# Altium schematic sheet Mainboard.SchDoc
size A2; SheetNumber: 1; SheetTotal: 1
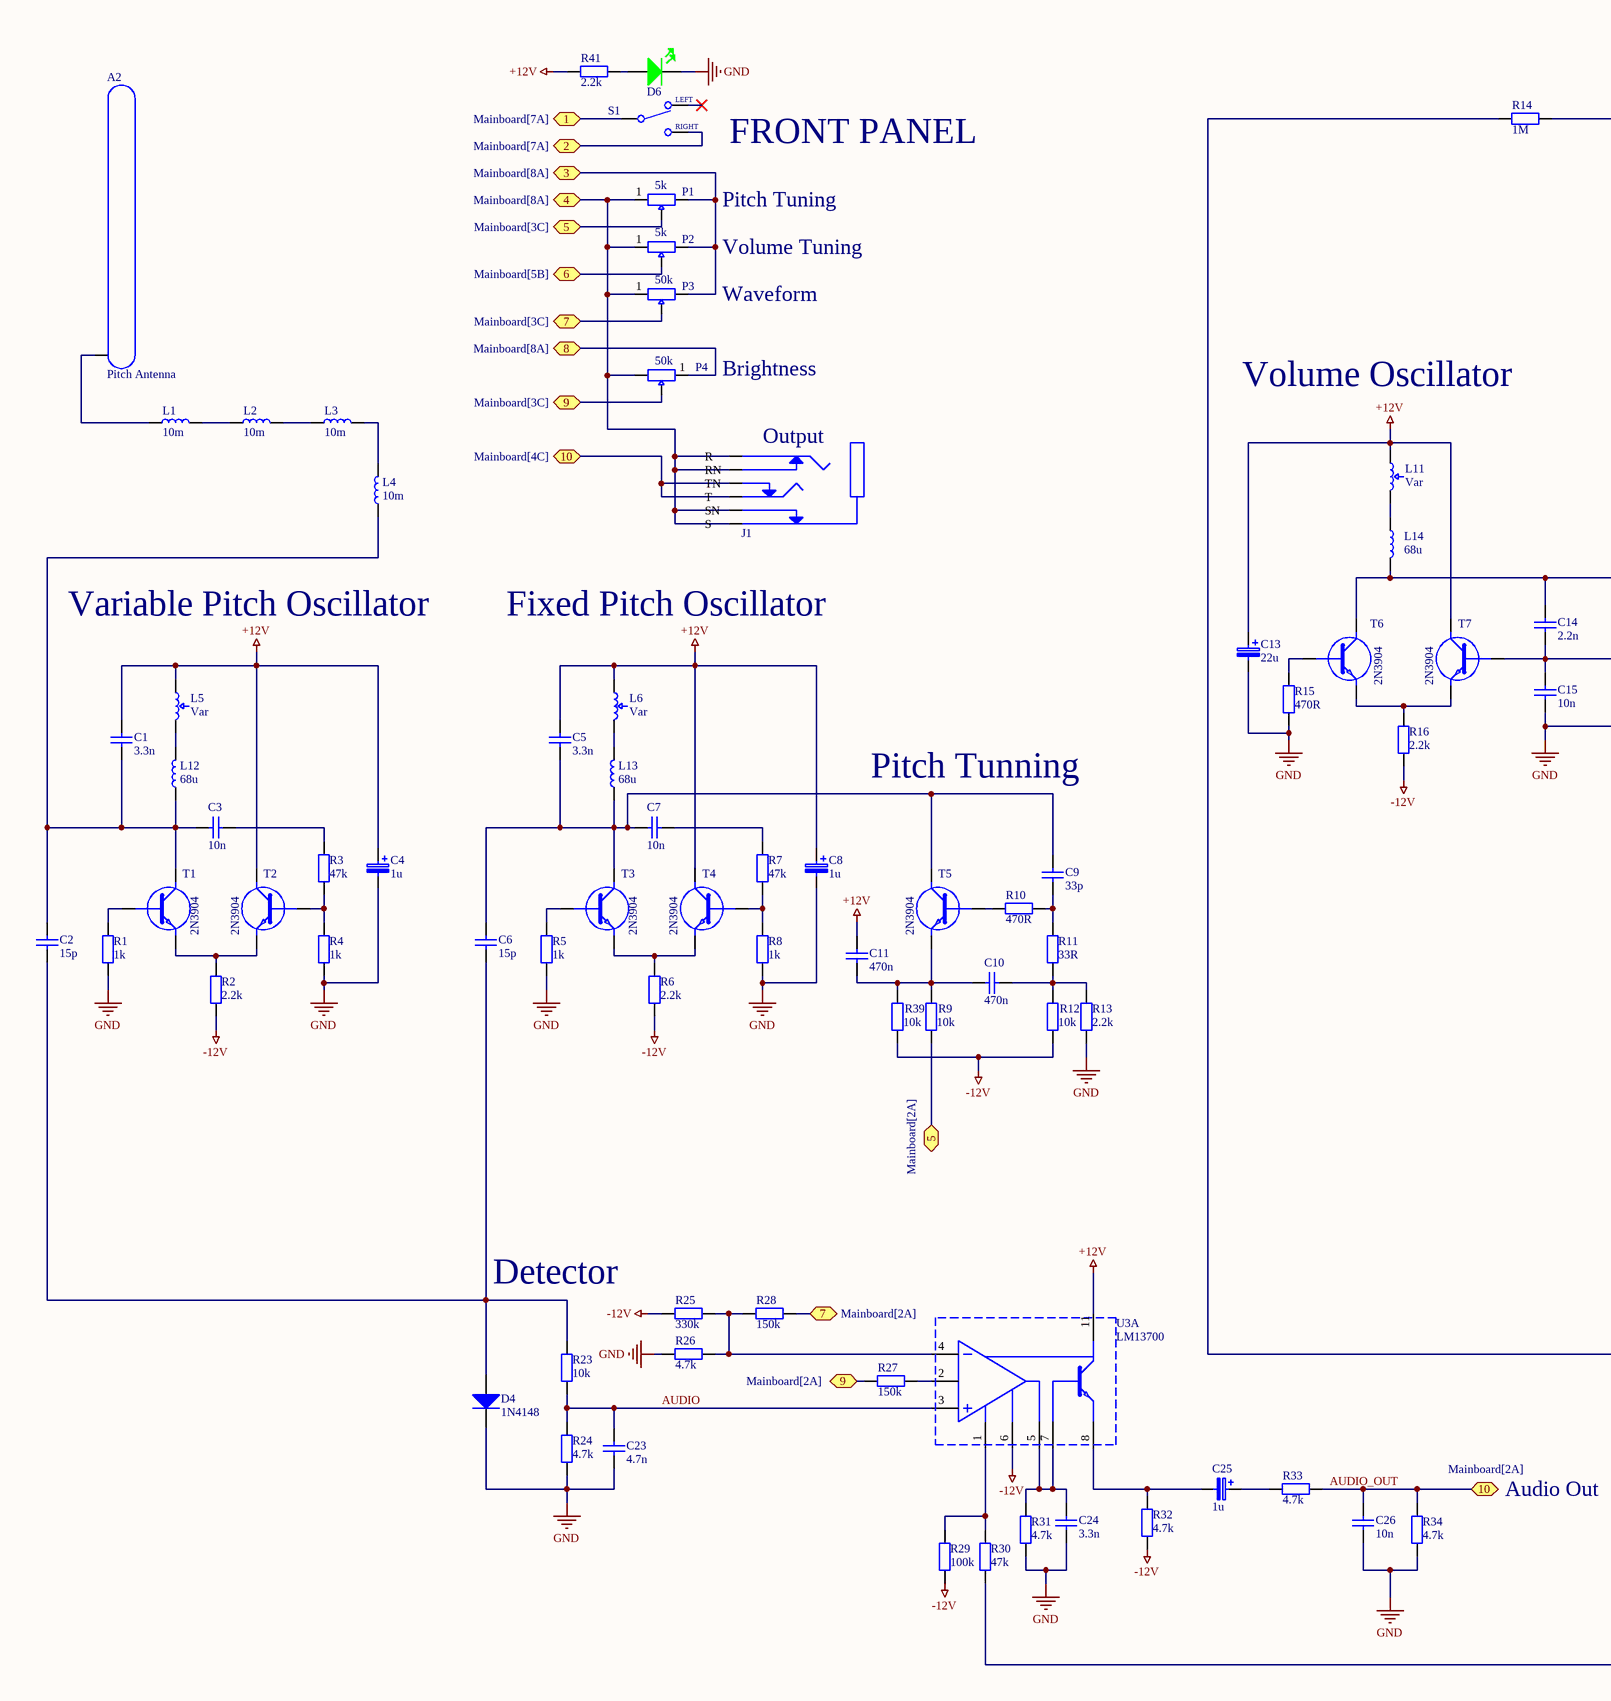
[diagram p0: Mainboard.SchDoc, left]
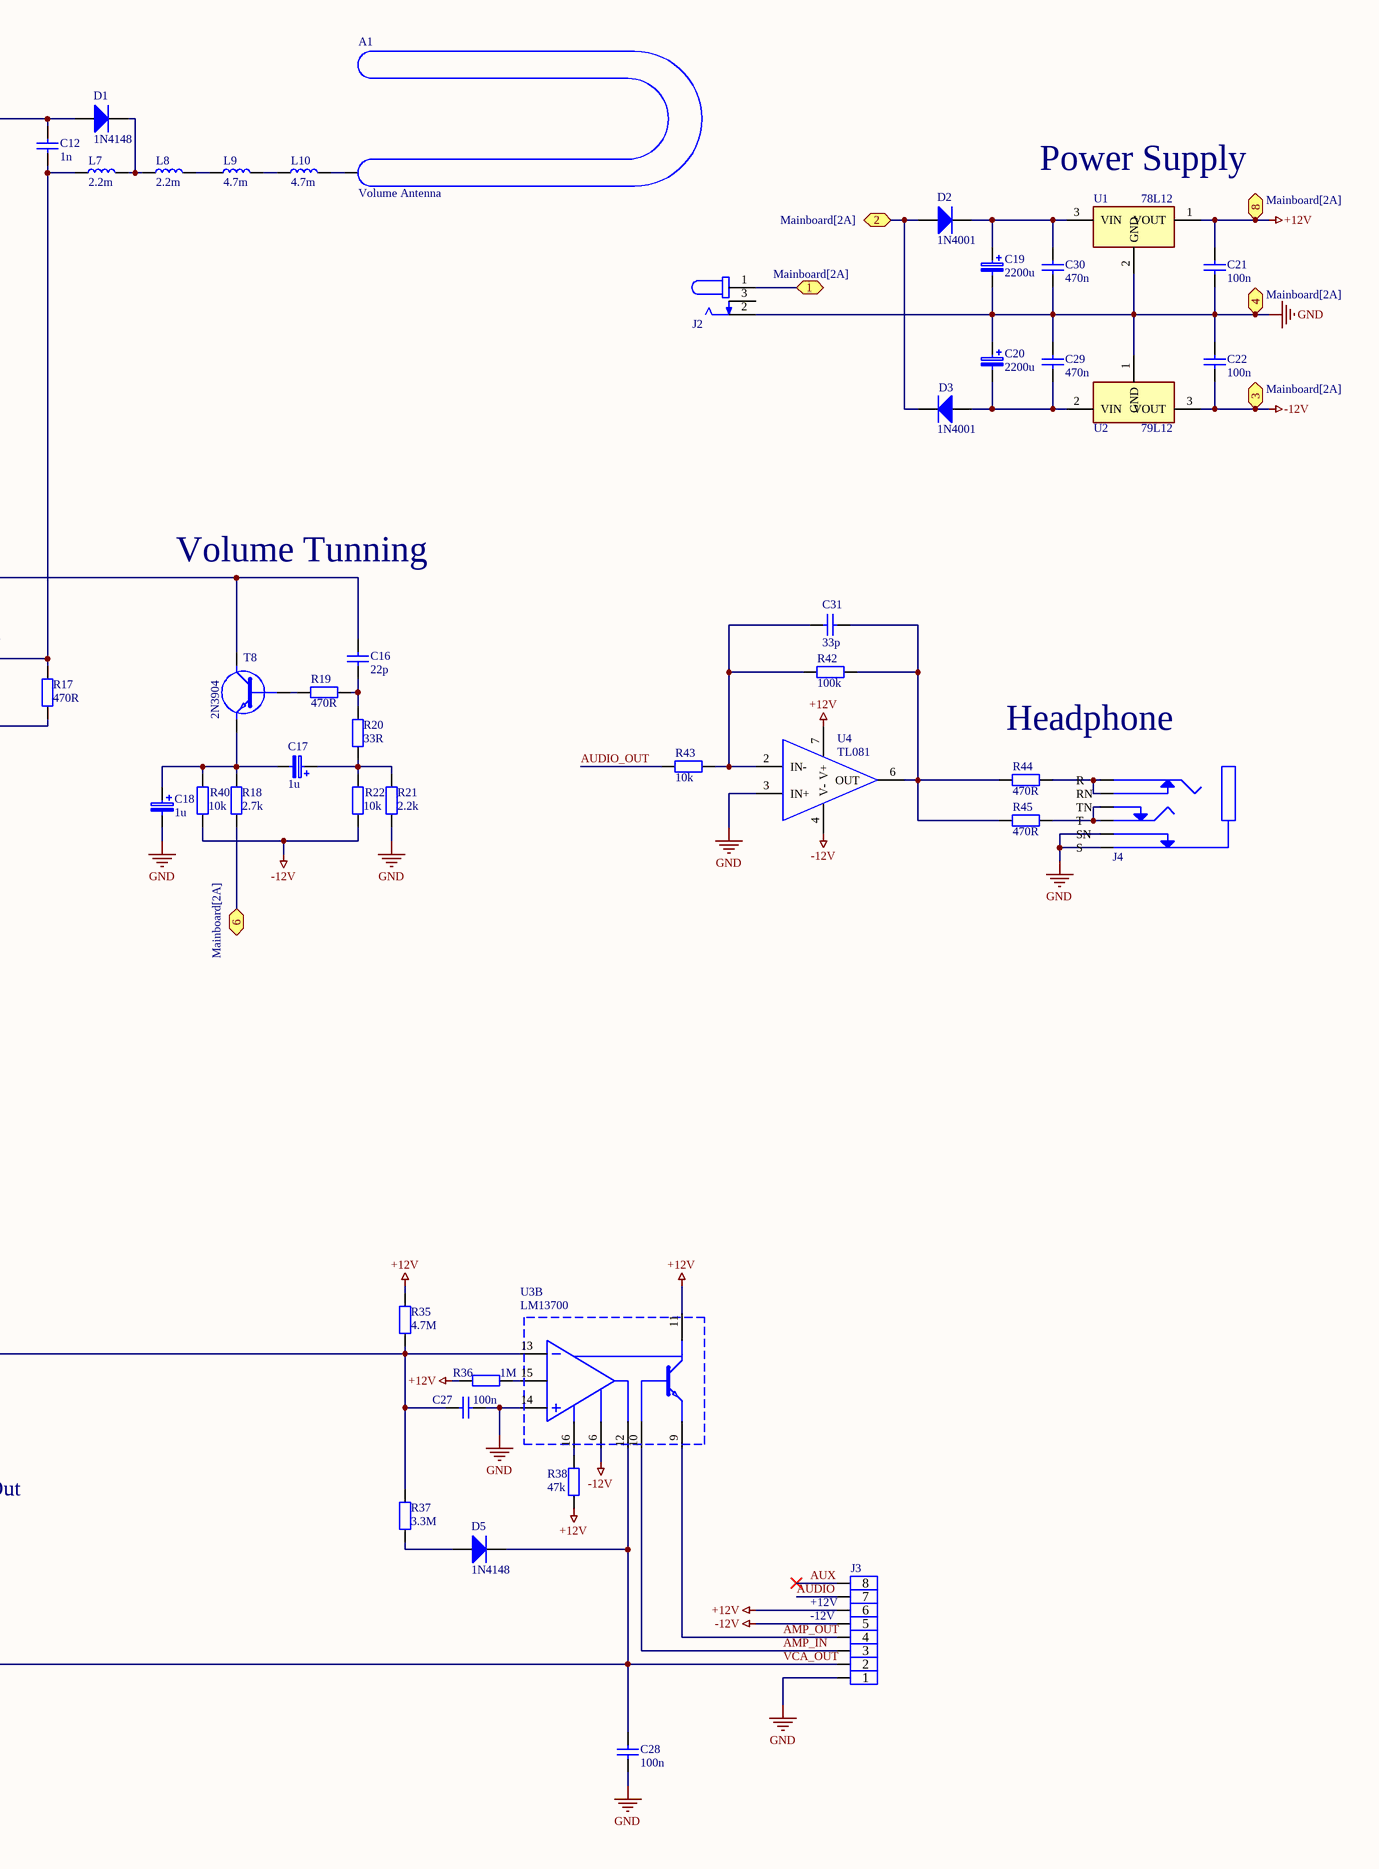
[diagram p1: Mainboard.SchDoc, right]

## Parts
A1  Volume Antenna  [HOLE M3]
A2  Pitch Antenna  [HOLE M3]
C1  3.3n  [Capacitor 7.2x3.5x6.5mm]
C2  15p  [Capacitor Ceramic]
C3  10n  [Capacitor 7.2x3.5x6.5mm]
C4  1u  [Capacitor Tantalum 5.08mm]
C5  3.3n  [Capacitor 7.2x3.5x6.5mm]
C6  15p  [Capacitor Ceramic]
C7  10n  [Capacitor 7.2x3.5x6.5mm]
C8  1u  [Capacitor Tantalum 5.08mm]
C9  33p  [Capacitor Ceramic]
C10  470n  [Capacitor 7.2x3.5x6.5mm]
C11  470n  [Capacitor 7.2x3.5x6.5mm]
C12  1n  [Capacitor 7.2x3.5x6.5mm]
C13  22u  [Capacitor Tantalum 5.08mm]
C14  2.2n  [Capacitor 7.2x3.5x6.5mm]
C15  10n  [Capacitor 7.2x3.5x6.5mm]
C16  22p  [Capacitor Ceramic]
C17  1u  [Capacitor Tantalum 5.08mm]
C18  1u  [Capacitor Tantalum 5.08mm]
C19  2200u  [Capacitor Electrolytic 16x25mm]
C20  2200u  [Capacitor Electrolytic 16x25mm]
C21  100n  [Capacitor 7.2x3.5x6.5mm]
C22  100n  [Capacitor 7.2x3.5x6.5mm]
C23  4.7n  [Capacitor 7.2x3.5x6.5mm]
C24  3.3n  [Capacitor 7.2x3.5x6.5mm]
C25  1u  [Capacitor Tantalum 5.08mm]
C26  10n  [Capacitor 7.2x3.5x6.5mm]
C27  100n  [Capacitor 7.2x3.5x6.5mm]
C28  100n  [Capacitor 7.2x3.5x6.5mm]
C29  470n  [Capacitor 7.2x3.5x6.5mm]
C30  470n  [Capacitor 7.2x3.5x6.5mm]
C31  33p  [Capacitor Ceramic]
D1  1N4148  [DO35]
D2  1N4001  [DO41]
D3  1N4001  [DO41]
D4  1N4148  [DO35]
D5  1N4148  [DO35]
D6  Green  [LED 5mm]  (value not drawn)
J1  JC-211  [Jack 6.3mm PCB]  (value not drawn)
J2  PC-GK2.1  [DC Supply THT]  (value not drawn)
J3  8 PIN  [Goldpin 8P]  (value not drawn)
J4  JC-211  [Jack 6.3mm PCB]  (value not drawn)
L1  10m  [Inductor 11.5x11.5]
L2  10m  [Inductor 11.5x11.5]
L3  10m  [Inductor 11.5x11.5]
L4  10m  [Inductor 11.5x11.5]
L5  Var  [Inductor Variable]
L6  Var  [Inductor Variable]
L7  2.2m  [Inductor 11.5x11.5]
L8  2.2m  [Inductor 11.5x11.5]
L9  4.7m  [Inductor 11.5x11.5]
L10  4.7m  [Inductor 11.5x11.5]
L11  Var  [Inductor Variable]
L12  68u  [Inductor Axial]
L13  68u  [Inductor Axial]
L14  68u  [Inductor Axial]
P1  5k  [Potentiometer Shaft]
P2  5k  [Potentiometer Shaft]
P3  50k  [Potentiometer Shaft]
P4  50k  [Potentiometer Shaft]
R1  1k  [Resistor 1/4W]
R2  2.2k  [Resistor 1/4W]
R3  47k  [Resistor 1/4W]
R4  1k  [Resistor 1/4W]
R5  1k  [Resistor 1/4W]
R6  2.2k  [Resistor 1/4W]
R7  47k  [Resistor 1/4W]
R8  1k  [Resistor 1/4W]
R9  10k  [Resistor 1/4W]
R10  470R  [Resistor 1/4W]
R11  33R  [Resistor 1/4W]
R12  10k  [Resistor 1/4W]
R13  2.2k  [Resistor 1/4W]
R14  1M  [Resistor 1/4W]
R15  470R  [Resistor 1/4W]
R16  2.2k  [Resistor 1/4W]
R17  470R  [Resistor 1/4W]
R18  2.7k  [Resistor 1/4W]
R19  470R  [Resistor 1/4W]
R20  33R  [Resistor 1/4W]
R21  2.2k  [Resistor 1/4W]
R22  10k  [Resistor 1/4W]
R23  10k  [Resistor 1/4W]
R24  4.7k  [Resistor 1/4W]
R25  330k  [Resistor 1/4W]
R26  4.7k  [Resistor 1/4W]
R27  150k  [Resistor 1/4W]
R28  150k  [Resistor 1/4W]
R29  100k  [Resistor 1/4W]
R30  47k  [Resistor 1/4W]
R31  4.7k  [Resistor 1/4W]
R32  4.7k  [Resistor 1/4W]
R33  4.7k  [Resistor 1/4W]
R34  4.7k  [Resistor 1/4W]
R35  4.7M  [Resistor 1/4W]
R36  1M  [Resistor 1/4W]
R37  3.3M  [Resistor 1/4W]
R38  47k  [Resistor 1/4W]
R39  10k  [Resistor 1/4W]
R40  10k  [Resistor 1/4W]
R41  2.2k  [Resistor 1/4W]
R42  100k  [Resistor 1/4W]
R43  10k  [Resistor 1/4W]
R44  470R  [Resistor 1/4W]
R45  470R  [Resistor 1/4W]
S1  ON-ON  [Switch Angled]  (value not drawn)
T1  2N3904  [TO-92]
T2  2N3904  [TO-92]
T3  2N3904  [TO-92]
T4  2N3904  [TO-92]
T5  2N3904  [TO-92]
T6  2N3904  [TO-92]
T7  2N3904  [TO-92]
T8  2N3904  [TO-92]
U1  78L12  [TO-92]
U2  79L12  [TO-92]
U3  LM13700  [SO-16]  (parts A,B of 2)
U4  TL081  [DIP-8]

## Ports
1 (bidir, see Mainboard[2A]), 1 (bidir, see Mainboard[7A]), 2 (bidir, see Mainboard[2A]), 2 (bidir, see Mainboard[7A]), 3 (bidir, see Mainboard[2A]), 3 (bidir, see Mainboard[8A]), 4 (bidir, see Mainboard[2A]), 4 (bidir, see Mainboard[8A]), 5 (bidir, see Mainboard[2A]), 5 (bidir, see Mainboard[3C]), 6 (bidir, see Mainboard[2A]), 6 (bidir, see Mainboard[5B]), 7 (bidir, see Mainboard[2A]), 7 (bidir, see Mainboard[3C]), 8 (bidir, see Mainboard[2A]), 8 (bidir, see Mainboard[8A]), 9 (bidir, see Mainboard[2A]), 9 (bidir, see Mainboard[3C]), 10 (bidir, see Mainboard[2A]), 10 (bidir, see Mainboard[4C])

## Nets
+12V: C1.2 C4.1 C5.2 C8.1 C11.2 C13.1 C21.1 J3.6 L5.2 L6.2 L11.2 P4.1 R35.2 R36.2 R38.1 R41.2 T2.3(C) T4.3(C) T7.3(C) U1.1(VOUT) U3.11(V+) U4.7(V+) ; port 8
-12V: C22.2 J3.5 P1.3 P2.3 P3.3 R2.1 R6.1 R12.1 R16.1 R22.1 R25.1 R29.1 R32.1 R39.1 R40.1 U2.3(VOUT) U3.6(V-) U4.4(V-) ; port 3
GND: C4.2 C8.2 C13.2 C15.1 C18.2 C19.2 C20.1 C21.2 C22.1 C23.1 C24.1 C26.1 C27.1 C28.1 C29.2 C30.1 D4.2 D6.2 J1.1(S) J1.2(R) J1.5(RN) J1.6(SN) J2.2 J3.1 J4.1(S) J4.6(SN) P1.1 P2.1 P3.1 P4.3 R1.1 R4.1 R5.1 R8.1 R13.1 R15.1 R17.1 R21.1 R24.1 R26.1 R31.1 R34.2 U1.2(GND) U2.1(GND) U3.14(+) U4.3(IN+) ; port 4
1: J2.1 S1.2 ; port 1
2: D2.1 D3.2 S1.3 ; port 2
5: P1.2 R9.1 ; port 5
6: P2.2 R18.1 ; port 6
7: P3.2 R28.2 ; port 7
9: P4.2 R27.2 ; port 9
AMP_IN: J3.3 U3.10(BUFFER_IN)
AMP_OUT: J3.4 U3.9(BUFFER_OUT)
AUDIO: C23.2 J3.7 R23.2 R24.2 U3.3(+)
AUDIO_OUT: C26.2 J1.3(T) J1.4(TN) R33.1 R34.1 R43.1 ; port 10
AUX: J3.8
VCA_OUT: C28.2 D5.2 J3.2 R30.1 U3.12(OUTPUT)
NetA1_1: A1.1 L10.2
NetA2_1: A2.1 L1.1
NetC1_1: C1.1 C2.2 C3.1 L4.1 L12.1 T1.3(C)
NetC2_1: C2.1 C6.1 D4.1 R23.1
NetC3_2: C3.2 R3.2
NetC5_1: C5.1 C6.2 C7.1 C9.2 L13.1 T3.3(C) T5.3(C)
NetC7_2: C7.2 R7.2
NetC9_1: C9.1 R10.2 R11.2
NetC10_1: C10.1 R11.1 R12.2 R13.2
NetC10_2: C10.2 C11.1 R9.2 R39.2 T5.1(E)
NetC12_1: C12.1 C14.1 C15.2 L7.1 R17.2 T7.2(B)
NetC12_2: C12.2 D1.1 R14.2
NetC14_2: C14.2 C16.2 L14.2 T6.3(C) T8.3(C)
NetC16_1: C16.1 R19.2 R20.2
NetC17_1: C17.1 R20.1 R21.2 R22.2
NetC17_2: C17.2 C18.1 R18.2 R40.2 T8.1(E)
NetC19_1: C19.1 C30.2 D2.2 U1.3(VIN)
NetC20_2: C20.2 C29.1 D3.1 U2.2(VIN)
NetC24_2: C24.2 R31.2 U3.5(OUTPUT) U3.7(BUFFER_IN)
NetC25_1: C25.1 R33.2
NetC25_2: C25.2 R32.2 U3.8(BUFFER_OUT)
NetC27_2: C27.2 R14.1 R35.1 R37.2 U3.13(-)
NetC31_1: C31.1 R42.1 R43.2 U4.2(IN-)
NetC31_2: C31.2 R42.2 R44.1 R45.1 U4.6(OUT)
NetD1_2: D1.2 L7.2 L8.1
NetD5_1: D5.1 R37.1
NetD6_1: D6.1 R41.1
NetJ4_2: J4.2(R) J4.5(RN) R44.2
NetJ4_3: J4.3(T) J4.4(TN) R45.2
NetL1_2: L1.2 L2.1
NetL2_2: L2.2 L3.2
NetL3_1: L3.1 L4.2
NetL5_1: L5.1 L12.2
NetL6_1: L6.1 L13.2
NetL8_2: L8.2 L9.1
NetL9_2: L9.2 L10.1
NetL11_1: L11.1 L14.1
NetR1_2: R1.2 T1.2(B)
NetR2_2: R2.2 T1.1(E) T2.1(E)
NetR3_1: R3.1 R4.2 T2.2(B)
NetR5_2: R5.2 T3.2(B)
NetR6_2: R6.2 T3.1(E) T4.1(E)
NetR7_1: R7.1 R8.2 T4.2(B)
NetR10_1: R10.1 T5.2(B)
NetR15_2: R15.2 T6.2(B)
NetR16_2: R16.2 T6.1(E) T7.1(E)
NetR19_1: R19.1 T8.2(B)
NetR25_2: R25.2 R26.2 R28.1 U3.4(-)
NetR27_1: R27.1 U3.2(BIAS_DIODE)
NetR29_2: R29.2 R30.2 U3.1(BIAS_AMP)
NetR36_1: R36.1 U3.15(BIAS_DIODE)
NetR38_2: R38.2 U3.16(BIAS_AMP)

Not connected (* = marked no-connect by the designer): J2 3; S1 1*

## Notes on the sheet
- FRONT PANEL
- (near U1) Power Supply
- Pitch Tuning
- Volume Tuning
- Waveform
- Brightness
- (near J1) Output
- Volume Oscillator
- Volume Tunning
- Variable Pitch Oscillator
- Fixed Pitch Oscillator
- Pitch Tunning
- Headphone
- Detector
- Audio Out
- (near J3) -12V
- (near J3) +12V
- (in symbol Mechanical Switch Angled SPDT THT) LEFT; RIGHT

## Library data of the parts
A1 = Mechanical Screw Antenna Volume M3: Supplier: *; MPN: *; Package: *; ComponentLink1Description: TME; ComponentLink1URL: *; ComponentLink2Description: Datasheet; ComponentLink2URL: *
A2 = Mechanical Screw Antenna Pitch M3: Supplier: *; MPN: *; Package: *; ComponentLink1Description: TME; ComponentLink1URL: *; ComponentLink2Description: Datasheet; ComponentLink2URL: *
C1 C5 C24 = Capacitor 3.3n 63VAC 5mm 5% MKT THT: Capacitor: polyester; 3.3nF; 63VAC; 100VDC; 5mm; ±5%; 7.2x2.5x6.5mm; MPN: R82EC1330DQ50J; Supplier: TME; Package: Capacitor 7.2x3.5x6.5mm; ComponentLink1Description: TME; ComponentLink1URL: https://www.tme.eu/pl/en/details/r82ec1330dq50j/tht-film-capacitors/kemet/; ComponentLink2Description: Datasheet; ComponentLink2URL: https://www.tme.eu/Document/4bebc873973008b4c7aff8be17e5b896/Datasheet-R82EC1330DQ50J.pdf
C2 C6 = Capacitor 15p 50VAC 5mm 5% C0G THT: Capacitor: ceramic; 15pF; 50V; C0G (NP0); ±5%; THT; 5mm; MPN: RDE5C1H150J0M1H03A; Supplier: TME; Package: Capacitor Ceramic; ComponentLink1Description: TME; ComponentLink1URL: https://www.tme.eu/pl/en/details/rde5c1h150j0m1h03a/mlcc-tht-capacitors/murata/; ComponentLink2Description: Datasheet; ComponentLink2URL: https://www.tme.eu/Document/2ff66c99fa6fcc1468aea77d2cec1eda/RDE.pdf
C3 C7 C15 C26 = Capacitor 10n 63VAC 5mm 10% MKT THT: Capacitor: polyester; 0.01uF; 63VAC; 100VDC; 5mm; ±10%; -55÷125°C; MPN: B32529C1103K289; Supplier: TME; Package: Capacitor 7.2x3.5x6.5mm; ComponentLink1Description: TME; ComponentLink1URL: https://www.tme.eu/pl/en/details/b32529c1103k289/tht-film-capacitors/epcos/; ComponentLink2Description: Datasheet; ComponentLink2URL: https://www.tme.eu/Document/3f797a4cbbe02b90e3e2061c5fb4dda0/B32520_529.pdf
C4 C8 C17 C18 C25 = Capacitor 1u 35VAC 2.54mm 10% Tantalum THT: Capacitor: tantalum; 1uF; 35VDC; THT; ±20%; -55÷85°C; 2.54mm; MPN: TC-1/35; Supplier: TME; Package: Capacitor Tantalum; ComponentLink1Description: TME; ComponentLink1URL: https://www.tme.eu/pl/en/details/tc-1_35/tht-tantalum-capacitors/sr-passives/; ComponentLink2Description: Datasheet; ComponentLink2URL: https://www.tme.eu/Document/bf051ef301f23e46aec8e57514aaa972/TC%20series.pdf
C9 C31 = Capacitor 33p 50VAC 5mm 5% C0G THT: Capacitor: ceramic; 33pF; 50V; C0G (NP0); ±5%; THT; 5mm; MPN: CT40805N330J500F3R; Supplier: TME; Package: Capacitor Ceramic; ComponentLink1Description: TME; ComponentLink1URL: https://www.tme.eu/pl/en/details/cct-33p_50v/mlcc-tht-capacitors/sr-passives/ct40805n330j500f3r/; ComponentLink2Description: Datasheet; ComponentLink2URL: https://www.tme.eu/Document/fa2074634c56a5d5a400b3d58e933b6f/CCT.pdf
C10 C11 C29 C30 = Capacitor 470n 63VAC 5mm 10% MKT THT: Capacitor: polyester; 470nF; 40VAC; 63VDC; 5mm; ±10%; 7.2x3.5x6.5mm; MPN: R82DC3470DQ60K; Supplier: TME; Package: Capacitor 7.2x3.5x6.5mm; ComponentLink1Description: TME; ComponentLink1URL: https://www.tme.eu/pl/en/details/r82dc3470dq60k/tht-film-capacitors/kemet/; ComponentLink2Description: Datasheet; ComponentLink2URL: https://www.tme.eu/Document/f9e14cfc4b971fc2817c26fd8f4fc9f4/Datasheet-R82DC3470DQ60K.pdf
C12 = Capacitor 1n 100VAC 5mm 10% MKT THT: Capacitor: polyester; 1nF; 63VAC; 100VDC; 5mm; ±10%; 7.2x2.5x6.5mm; MPN: R82EC1100DQ50K; Supplier: TME; Package: Capacitor 7.2x3.5x6.5mm; ComponentLink1Description: TME; ComponentLink1URL: https://www.tme.eu/pl/en/details/r82ec1100dq50k/tht-film-capacitors/kemet/; ComponentLink2Description: Datasheet; ComponentLink2URL: https://www.tme.eu/Document/8279ba60e40a85f8e396f800f0d02c79/Datasheet-R82EC1100DQ50K.pdf
C13 = Capacitor 22u 35VAC 2.54mm 20% Tantalum THT: Capacitor: tantalum; 22uF; 35VDC; THT; ±20%; -55÷85°C; 5.08mm; MPN: TC-22/35; Supplier: TME; Package: Capacitor Tantalum 5.08mm; ComponentLink1Description: TME; ComponentLink1URL: https://www.tme.eu/pl/en/details/tc-22_35/tht-tantalum-capacitors/sr-passives/; ComponentLink2Description: Datasheet; ComponentLink2URL: https://www.tme.eu/Document/bf051ef301f23e46aec8e57514aaa972/TC%20series.pdf
C14 = Capacitor 2.2n 63VAC 5mm 10% MKT THT: Capacitor: polyester; 2.2nF; 63VAC; 100VDC; 5mm; ±10%; -55÷105°C; MPN: R82EC1220DQ50K; Supplier: TME; Package: Capacitor 7.2x3.5x6.5mm; ComponentLink1Description: TME; ComponentLink1URL: https://www.tme.eu/pl/en/details/mc5-2n2/tht-film-capacitors/kemet/r82ec1220dq50k/; ComponentLink2Description: Datasheet; ComponentLink2URL: https://www.tme.eu/Document/3a484b0e6621be75ef1153478ce25df0/R82EC1220DQ50K.pdf
C16 = Capacitor 22p 50VAC 5mm 5% C0G THT: Capacitor: ceramic; 22pF; 50V; C0G (NP0); ±5%; THT; 5mm; MPN: CT40805N220J500F3R; Supplier: TME; Package: Capacitor Ceramic; ComponentLink1Description: TME; ComponentLink1URL: https://www.tme.eu/pl/en/details/cct-22p_50v/mlcc-tht-capacitors/sr-passives/ct40805n220j500f3r/; ComponentLink2Description: Datasheet; ComponentLink2URL: https://www.tme.eu/Document/fa2074634c56a5d5a400b3d58e933b6f/CCT.pdf
C19 C20 = Capacitor 2200u 35VDC 7.5mm 20% Electrolytic THT: Capacitor: electrolytic; THT; 2200uF; 35VDC; Ø16x25mm; Pitch: 7.5mm; MPN: EWH1VM222L25OT; Supplier: TME; Package: Capacitor Electrolytic 16x25mm; ComponentLink1Description: TME; ComponentLink1URL: https://www.tme.eu/pl/en/details/ce-2200_35pht-y/tht-electrolytic-capacitors/aishi/ewh1vm222l25ot/; ComponentLink2Description: Datasheet; ComponentLink2URL: https://www.tme.eu/Document/d4ed5160d67f7d07e14b13c551409f2c/WH-series.pdf
C21 C22 C27 C28 = Capacitor 100n 63VAC 5mm 10% MKT THT: Capacitor: polyester; 100nF; 63VAC; 100VDC; 5mm; ±10%; -55÷100°C; MPN: MKS2D031001A00KSSD; Supplier: TME; Package: Capacitor 7.2x3.5x6.5mm; ComponentLink1Description: TME; ComponentLink1URL: https://www.tme.eu/pl/en/details/mks2-100n_100/tht-film-capacitors/wima/mks2d031001a00kssd/; ComponentLink2Description: Datasheet; ComponentLink2URL: https://www.tme.eu/Document/a1d7ff07b330f8f08de986bd168d8c92/WIMA_MKS_2.pdf
C23 = Capacitor 4.7n 63VAC 5mm 5% MKT THT: Capacitor: polyester; 4.7nF; 63VAC; 100VDC; 5mm; ±10%; -55÷105°C; MPN: R82EC1470DQ50K; Supplier: TME; Package: Capacitor 7.2x3.5x6.5mm; ComponentLink1Description: TME; ComponentLink1URL: https://www.tme.eu/pl/en/details/r82ec1470dq50k/tht-film-capacitors/kemet/; ComponentLink2Description: Datasheet; ComponentLink2URL: https://www.tme.eu/Document/9d3537aef72e8ccc93f83dd784419bb5/Datasheet-R82EC1470DQ50K.pdf
D1 D4 D5 = Diode Signal DO35 1N4148 THT: Diode: switching; THT; 100V; 0.2A; Ammo Pack; Ifsm: 4A; DO35; 500mW; Supplier: TME; MPN: 1N4148; Package: DO-35; ComponentLink1Description: TME; ComponentLink1URL: https://www.tme.eu/pl/en/details/1n4148-dio/tht-universal-diodes/diotec-semiconductor/1n4148/; ComponentLink2Description: Datasheet; ComponentLink2URL: https://www.tme.eu/Document/c6f6445616a0da67965224a113dd79b5/1n4148.pdf
D2 D3 = Diode Power DO41 1N4001 THT: Diode: rectifying; THT; 50V; 1A; Ammo Pack; Ifsm: 30A; DO41; Supplier: TME; MPN: 1N4001; Package: DO-41; ComponentLink1Description: TME; ComponentLink1URL: https://www.tme.eu/pl/en/details/1n4001-cdi/tht-universal-diodes/cdil/1n4001/; ComponentLink2Description: Datasheet; ComponentLink2URL: https://www.tme.eu/Document/8a0c0b7e643996c9a2ecfdce46dc9310/1n4001_7.pdf
D6 = Diode LED 5mm THT Green Diffused: LED; 5mm; green; 150÷350mcd; 45°; 1.9÷2.4V; No.of term: 2; -40÷85°C; MPN: N0G02L47; Supplier: TME; Package: LED 5mm; ComponentLink1Description: TME; ComponentLink1URL: https://www.tme.eu/pl/en/details/n0g02l47/tht-leds-round/brightek-europe/; ComponentLink2Description: Datasheet; ComponentLink2URL: https://www.tme.eu/Document/d4dc47f49ec801a892b442bf96adea2e/N0G02L47.pdf
J1 J4 = Mechanical Jack 6.3mm Mono: Socket; Jack 6,3mm; female; mono; ways: 2; for panel mounting; THT; ComponentLink1Description: TME; ComponentLink1URL: https://www.tme.eu/pl/en/details/jc-211/jack-connectors/ninigi/; Supplier: TME; MPN: JC-211; Package: Jack 6.3mm PCB; ComponentLink2Description: Datasheet; ComponentLink2URL: https://www.tme.eu/html/EN/connector-jack-6-3mm-socket/ramka_770_EN_pelny.html
J2 = Mechanical DC Conector 5.5/2.1mm THT: Socket; DC supply; male; 5.5/2.1mm; 5.5mm; 2.1mm; THT; angled 90°; ComponentLink1Description: TME; ComponentLink1URL: https://www.tme.eu/pl/en/details/pc-gk2.1/dc-power-connectors/ninigi/; Supplier: TME; MPN: PC-GK2.1; Package: DC Supply THT; ComponentLink2Description: Datasheet; ComponentLink2URL: https://www.tme.eu/Document/78afd4fb8a41e4211137cd818ea9e93d/PC-GK21.jpg
J3 = Mechanical Pinheader Male 8pin P=2.54mm THT: Pin header; pin strips; male; PIN: 8; straight; 2.54mm; THT; 1x8; MPN: DS1021-1*8SF11-B; ComponentLink1Description: TME; ComponentLink1URL: https://www.tme.eu/pl/en/details/zl201-08g/pin-headers/connfly/ds1021-1-8sf11-b/; Supplier: TME; Package: Goldpin 8P; ComponentLink2Description: Datasheet; ComponentLink2URL: https://www.tme.eu/Document/cc301e58a5da78cb543a94b5a5b7f06a/DS1021.pdf
L1-L4 = Inductor Axial 10mH 250mA THT: Inductor: wire; THT; 10mH; Ioper: 250mA; 14.6Ω; ±10%; Ø11.5x11.5mm; MPN: COIL1010-10; Supplier: TME; Package: Inductor 11.5x11.5; ComponentLink1Description: TME; ComponentLink1URL: https://www.tme.eu/pl/en/details/coil1010-10/vertical-inductors/ferrocore/; ComponentLink2Description: Datasheet; ComponentLink2URL: https://www.tme.eu/Document/a3ef0c8e49e99149fdccea630d52d5e9/COIL1010-10.pdf
L5 L6 L11 = Inductor Variable 13-34uH THT: 10pcs 50T 13uh-34uH Adjustable High-Frequency Ferrite Core Inductor Adjustable Tools; Supplier: Aliexpress; MPN: 50T 13uh-34uH; Package: Inductor Variable; ComponentLink1Description: TME; ComponentLink1URL: https://www.aliexpress.com/item/1005006270702263.html?spm=a2g0o.detail.pcDetailTopMoreOtherSeller.2.1643C9ZPC9ZPRj&gps-id=pcDetailTopMoreOtherSeller&scm=1007.40050.354490.0&scm_id=1007.40050.354490.0&scm-url=1007.40050.354490.0&pvid=d581bdb9-6c7a-4b34-acbb-bb23191a4599&_t=gps-id%3ApcDetailTopMoreOtherSeller%2Cscm-url%3A1007.40050.354490.0%2Cpvid%3Ad581bdb9-6c7a-4b34-acbb-bb23191a4599%2Ctpp_buckets%3A668%232846%238114%231999&pdp_npi=4%40dis%21PLN%2114.92%2114.92%21%21%213.63%213.63%21%402103835c17200115452615440e62f8%2112000036547480925%21rec%21PL%212048866767%21&utparam-url=scene%3ApcDetailTopMoreOtherSeller%7Cquery_from%3A; ComponentLink2Description: Datasheet; ComponentLink2URL: https://www.aliexpress.com/item/1005003388187155.html?spm=a2g0o.detail.pcDetailBottomMoreOtherSeller.18.5314Fwk8Fwk8NR&gps-id=pcDetailBottomMoreOtherSeller&scm=1007.40050.354490.0&scm_id=1007.40050.354490.0&scm-url=1007.40050.354490.0&pvid=505bda8a-ca01-4575-9f04-1e1694ae9eac&_t=gps-id:pcDetailBottomMoreOtherSeller,scm-url:1007.40050.354490.0,pvid:505bda8a-ca01-4575-9f04-1e1694ae9eac,tpp_buckets:668%232846%238109%231935&pdp_npi=4%40dis%21PLN%2110.65%2110.64%21%21%2118.93%2118.92%21%402101fb1417200120873824499ee372%2112000031929978882%21rec%21PL%212048866767%21&utparam-url=scene%3ApcDetailBottomMoreOtherSeller%7Cquery_from%3A
L7 L8 = Inductor Axial 2.2mH 550mA THT: Inductor: wire; THT; 2.2mH; Ioper: 550mA; 3.5Ω; ±10%; Ø11.5x11.5mm; MPN: COIL1010-2.2; Supplier: TME; Package: Inductor 11.5x11.5; ComponentLink1Description: TME; ComponentLink1URL: https://www.tme.eu/pl/en/details/coil1010-2.2/vertical-inductors/ferrocore/; ComponentLink2Description: Datasheet; ComponentLink2URL: https://www.tme.eu/Document/6a7075a9f3d9071c6798a7b1b2ed519f/COIL1010-2.2.pdf
L9 L10 = Inductor Axial 4.7mH 400mA THT: Inductor: wire; THT; 4.7mH; Ioper: 400mA; 6Ω; ±10%; Ø11.5x11.5mm; MPN: COIL1010-4.7; Supplier: TME; Package: Inductor 11.5x11.5; ComponentLink1Description: TME; ComponentLink1URL: https://www.tme.eu/pl/en/details/coil1010-4.7/vertical-inductors/ferrocore/; ComponentLink2Description: Datasheet; ComponentLink2URL: https://www.tme.eu/Document/ea6622b2319f67b3f9813ba7d6b98bb4/COIL1010-4.7.pdf
L12 L13 = Inductor Axial 68uH 185mA THT: Inductor: axial; THT; 68uH; 185mA; 3.2Ω; Ø3x8mm; MPN: DLA68-N; Supplier: TME; Package: Inductor Axial; ComponentLink1Description: TME; ComponentLink1URL: https://www.tme.eu/pl/en/details/dla68-n/axial-inductors/ferrocore/; ComponentLink2Description: Datasheet; ComponentLink2URL: https://www.tme.eu/Document/9d377c1aa3fb18bfc9d945d5bc61a17d/DLA_a.pdf
L14 = Inductor Axial 47uH 205mA THT: Inductor: axial; THT; 47uH; 205mA; 2.3Ω; Ø3x8mm; MPN: DLA47-N; Supplier: TME; Package: Inductor Axial; ComponentLink1Description: TME; ComponentLink1URL: https://www.tme.eu/pl/en/details/dla47-n/axial-inductors/ferrocore/; ComponentLink2Description: Datasheet; ComponentLink2URL: https://www.tme.eu/Document/9d377c1aa3fb18bfc9d945d5bc61a17d/DLA_a.pdf
P1 P2 = Potentiometer 5k 1/4W 5% THT: Potentiometer: shaft; single turn; 5kΩ; 125mW; ±20%; THT; 6mm; metal; MPN: R16148D-1A-2-B5K; Supplier: TME; Package: Potentiometer Shaft; ComponentLink1Description: TME; ComponentLink1URL: https://www.tme.eu/pl/en/details/r16148d-1a-2-b5k/carbon-single-turn-potentiometers/sr-passives/; ComponentLink2Description: Datasheet; ComponentLink2URL: https://www.tme.eu/html/EN/sr-passives-carbon-potentiometers-with-6-mm-shaft/ramka_16064_EN_pelny.html
P3 P4 = Potentiometer 50k 1/4W 5% THT: Potentiometer: shaft; single turn; 50kΩ; 125mW; ±20%; THT; 6mm; mono; MPN: R16148D-1A-2-B50K; Supplier: TME; Package: Potentiometer Shaft; ComponentLink1Description: TME; ComponentLink1URL: https://www.tme.eu/pl/en/details/r16148d-1a-2-b50k/carbon-single-turn-potentiometers/sr-passives/; ComponentLink2Description: Datasheet; ComponentLink2URL: https://www.tme.eu/html/EN/sr-passives-carbon-potentiometers-with-6-mm-shaft/ramka_16064_EN_pelny.html
R1 R4 R5 R8 = Resistor 1k 1/4W 5% THT: Resistor: carbon film; THT; 1kΩ; 0.25W; ±5%; Ø2.3x6mm; axial; MPN: CF1/4W-1K; Supplier: TME; Package: Resistor 1/4W; ComponentLink1Description: TME; ComponentLink1URL: https://www.tme.eu/pl/en/details/cf1_4w-1k/tht-resistors/sr-passives/; ComponentLink2Description: Datasheet; ComponentLink2URL: https://www.tme.eu/Document/3b68a2c15adddc45017f1757c33e8b45/cf_resistor.pdf
R2 R6 R13 R16 R21 R41 = Resistor 2.2k 1/4W 5% THT: Resistor: carbon film; THT; 2.2kΩ; 0.25W; ±5%; Ø2.3x6mm; axial; MPN: CF1/4W-2K2; Supplier: TME; Package: Resistor 1/4W; ComponentLink1Description: TME; ComponentLink1URL: https://www.tme.eu/pl/en/details/cf1_4w-2k2/tht-resistors/sr-passives/; ComponentLink2Description: Datasheet; ComponentLink2URL: https://www.tme.eu/Document/3b68a2c15adddc45017f1757c33e8b45/cf_resistor.pdf
R3 R7 R30 R38 = Resistor 47k 1/4W 5% THT: Resistor: carbon film; THT; 47kΩ; 0.25W; ±5%; Ø2.3x6mm; axial; MPN: CF1/4W-47K; Supplier: TME; Package: Resistor 1/4W; ComponentLink1Description: TME; ComponentLink1URL: https://www.tme.eu/pl/en/details/cf1_4w-47k/tht-resistors/sr-passives/; ComponentLink2Description: Datasheet; ComponentLink2URL: https://www.tme.eu/Document/3b68a2c15adddc45017f1757c33e8b45/cf_resistor.pdf
R9 R12 R22 R23 R39 R40 R43 = Resistor 10k 1/4W 5% THT: Resistor: carbon film; THT; 10kΩ; 0.25W; ±5%; Ø2.3x6mm; axial; MPN: CF1/4W-10K; Supplier: TME; Package: Resistor 1/4W; ComponentLink1Description: TME; ComponentLink1URL: https://www.tme.eu/pl/en/details/cf1_4w-10k/tht-resistors/sr-passives/; ComponentLink2Description: Datasheet; ComponentLink2URL: https://www.tme.eu/Document/3b68a2c15adddc45017f1757c33e8b45/cf_resistor.pdf
R10 R15 R17 R19 R44 R45 = Resistor 470R 1/4W 5% THT: Resistor: carbon film; THT; 470Ω; 0.25W; ±5%; Ø2.3x6mm; axial; MPN: CF1/4W-470R; Supplier: TME; Package: Resistor 1/4W; ComponentLink1Description: TME; ComponentLink1URL: https://www.tme.eu/pl/en/details/cf1_4w-470r/tht-resistors/sr-passives/; ComponentLink2Description: Datasheet; ComponentLink2URL: https://www.tme.eu/Document/3b68a2c15adddc45017f1757c33e8b45/cf_resistor.pdf
R11 R20 = Resistor 33R 1/4W 5% THT: Resistor: carbon film; THT; 33Ω; 0.25W; ±5%; Ø2.3x6mm; axial; MPN: CF1/4W-33R; Supplier: TME; Package: Resistor 1/4W; ComponentLink1Description: TME; ComponentLink1URL: https://www.tme.eu/pl/en/details/cf1_4w-33r/tht-resistors/sr-passives/; ComponentLink2Description: Datasheet; ComponentLink2URL: https://www.tme.eu/Document/3b68a2c15adddc45017f1757c33e8b45/cf_resistor.pdf
R14 R36 = Resistor 1M 1/4W 5% THT: Resistor: carbon film; THT; 1MΩ; 0.25W; ±5%; Ø2.3x6mm; axial; MPN: CF1/4W-1M; Supplier: TME; Package: Resistor 1/4W; ComponentLink1Description: TME; ComponentLink1URL: https://www.tme.eu/pl/en/details/cf1_4w-1m/tht-resistors/sr-passives/; ComponentLink2Description: Datasheet; ComponentLink2URL: https://www.tme.eu/Document/3b68a2c15adddc45017f1757c33e8b45/cf_resistor.pdf
R18 = Resistor 2.7k 1/4W 5% THT: Resistor: carbon film; THT; 2.7kΩ; 0.25W; ±5%; Ø2.3x6mm; axial; MPN: CF1/4W-2K7; Supplier: TME; Package: Resistor 1/4W; ComponentLink1Description: TME; ComponentLink1URL: https://www.tme.eu/pl/en/details/cf1_4w-2k7/tht-resistors/sr-passives/; ComponentLink2Description: Datasheet; ComponentLink2URL: https://www.tme.eu/Document/3b68a2c15adddc45017f1757c33e8b45/cf_resistor.pdf
R24 R26 R31-R34 = Resistor 4.7k 1/4W 5% THT: Resistor: carbon film; THT; 4.7kΩ; 0.25W; ±5%; Ø2.3x6mm; axial; MPN: CF1/4W-4K7; Supplier: TME; Package: Resistor 1/4W; ComponentLink1Description: TME; ComponentLink1URL: https://www.tme.eu/pl/en/details/cf1_4w-4k7/tht-resistors/sr-passives/; ComponentLink2Description: Datasheet; ComponentLink2URL: https://www.tme.eu/Document/3b68a2c15adddc45017f1757c33e8b45/cf_resistor.pdf
R25 = Resistor 330k 1/4W 5% THT: Resistor: carbon film; THT; 330kΩ; 0.25W; ±5%; Ø2.3x6mm; axial; MPN: CF1/4W-330K; Supplier: TME; Package: Resistor 1/4W; ComponentLink1Description: TME; ComponentLink1URL: https://www.tme.eu/pl/en/details/cf1_4w-330k/tht-resistors/sr-passives/; ComponentLink2Description: Datasheet; ComponentLink2URL: https://www.tme.eu/Document/3b68a2c15adddc45017f1757c33e8b45/cf_resistor.pdf
R27 R28 = Resistor 150k 1/4W 5% THT: Resistor: carbon film; THT; 150kΩ; 0.25W; ±5%; Ø2.3x6mm; axial; MPN: CF1/4W-150K; Supplier: TME; Package: Resistor 1/4W; ComponentLink1Description: TME; ComponentLink1URL: https://www.tme.eu/pl/en/details/cf1_4w-150k/tht-resistors/sr-passives/; ComponentLink2Description: Datasheet; ComponentLink2URL: https://www.tme.eu/Document/3b68a2c15adddc45017f1757c33e8b45/cf_resistor.pdf
R29 R42 = Resistor 100k 1/4W 5% THT: Resistor: carbon film; THT; 100kΩ; 0.25W; ±5%; Ø2.3x6mm; axial; MPN: CF1/4W-100K; Supplier: TME; Package: Resistor 1/4W; ComponentLink1Description: TME; ComponentLink1URL: https://www.tme.eu/pl/en/details/cf1_4w-100k/tht-resistors/sr-passives/; ComponentLink2Description: Datasheet; ComponentLink2URL: https://www.tme.eu/Document/3b68a2c15adddc45017f1757c33e8b45/cf_resistor.pdf
R35 = Resistor 4.7M 1/4W 5% THT: Resistor: carbon film; THT; 4.7MΩ; 0.25W; ±5%; Ø2.3x6mm; axial; MPN: CF1/4W-4M7; Supplier: TME; Package: Resistor 1/4W; ComponentLink1Description: TME; ComponentLink1URL: https://www.tme.eu/pl/en/details/cf1_4w-4m7/tht-resistors/sr-passives/; ComponentLink2Description: Datasheet; ComponentLink2URL: https://www.tme.eu/Document/3b68a2c15adddc45017f1757c33e8b45/cf_resistor.pdf
R37 = Resistor 3.3M 1/4W 5% THT: Resistor: carbon film; THT; 3.3MΩ; 0.25W; ±5%; Ø2.3x6mm; axial; MPN: CF1/4W-3M3; Supplier: TME; Package: Resistor 1/4W; ComponentLink1Description: TME; ComponentLink1URL: https://www.tme.eu/pl/en/details/cf1_4w-3m3/tht-resistors/sr-passives/; ComponentLink2Description: Datasheet; ComponentLink2URL: https://www.tme.eu/Document/3b68a2c15adddc45017f1757c33e8b45/cf_resistor.pdf
S1 = Mechanical Switch Angled SPDT THT: Switch: toggle; Pos: 2; SPDT; ON-ON; 0.4A/28VDC; -30÷85°C; 20mΩ; MPN: SKS06LP; ComponentLink1Description: TME; ComponentLink1URL: https://www.tme.eu/pl/en/details/sks06lp/toggle-switches/salecom-electronics/; Supplier: TME; Package: Switch Angled; ComponentLink2Description: Datasheet; ComponentLink2URL: https://www.tme.eu/html/EN/toggle-switches-sks-series/ramka_1363_EN_pelny.html
T1-T8 = Transistor NPN 2N3904 THT: Transistor: NPN; bipolar; 40V; 0.2A; 625mW; TO92; Supplier: TME; MPN: 2N3904; Package: TO-92; ComponentLink1Description: TME; ComponentLink1URL: https://www.tme.eu/pl/en/details/2n3904-dio/npn-tht-transistors/diotec-semiconductor/2n3904/; ComponentLink2Description: Datasheet; ComponentLink2URL: https://www.tme.eu/Document/8a561b8ad2a957afc05007bfcf57ac08/2n3904.pdf
U1 = IC LDO 12V 0.1A TO92 THT: IC: voltage regulator; linear,fixed; 12V; 0.1A; TO92; THT; bulk; MPN: MC78L12ACPG; Supplier: TME; Package: TO-92; ComponentLink1Description: TME; ComponentLink1URL: https://www.tme.eu/pl/en/details/mc78l12acpg/unregulated-voltage-regulators/onsemi/; ComponentLink2Description: Datasheet; ComponentLink2URL: https://www.tme.eu/Document/a8a1241ebb79c81cfad04f65b61400f5/MC78LxxA_NCV78LxxA.PDF
U2 = IC LDO -12V 0.1A TO92 THT: IC: voltage regulator; linear,fixed; -12V; 0.1A; TO92; THT; bulk; MPN: MC79L12ACPG; Supplier: TME; Package: TO-92; ComponentLink1Description: TME; ComponentLink1URL: https://www.tme.eu/pl/en/details/mc79l12acpg/unregulated-voltage-regulators/onsemi/; ComponentLink2Description: Datasheet; ComponentLink2URL: https://www.tme.eu/Document/da4ea255632af3160227aa919f13c59f/MC79L00A.PDF
U3 = IC OTA 2MHz SO16 SMD: IC: operational amplifier; 2MHz; Ch: 2; SO16;; MPN: LM13700MX/NOPB; Supplier: TME; Package: SO-16; ComponentLink1Description: TME; ComponentLink1URL: https://www.tme.eu/pl/en/details/lm13700mx_nopb/smd-operational-amplifiers/texas-instruments/; ComponentLink2Description: Datasheet; ComponentLink2URL: https://www.ti.com/lit/gpn/lm13700
U4 = IC OP-AMP 3MHz TL081 DIP8: IC: operational amplifier; 3MHz; Ch: 1; DIP8; ±5÷15VDC; tube; MPN: TL081IP; Supplier: TME; Package: DIP-8; ComponentLink1Description: TME; ComponentLink1URL: https://www.tme.eu/pl/en/details/tl081ip/tht-operational-amplifiers/texas-instruments/; ComponentLink2Description: Datasheet; ComponentLink2URL: https://www.st.com/resource/en/datasheet/tl081.pdf